# Altium project PCB_Project.PrjPcb
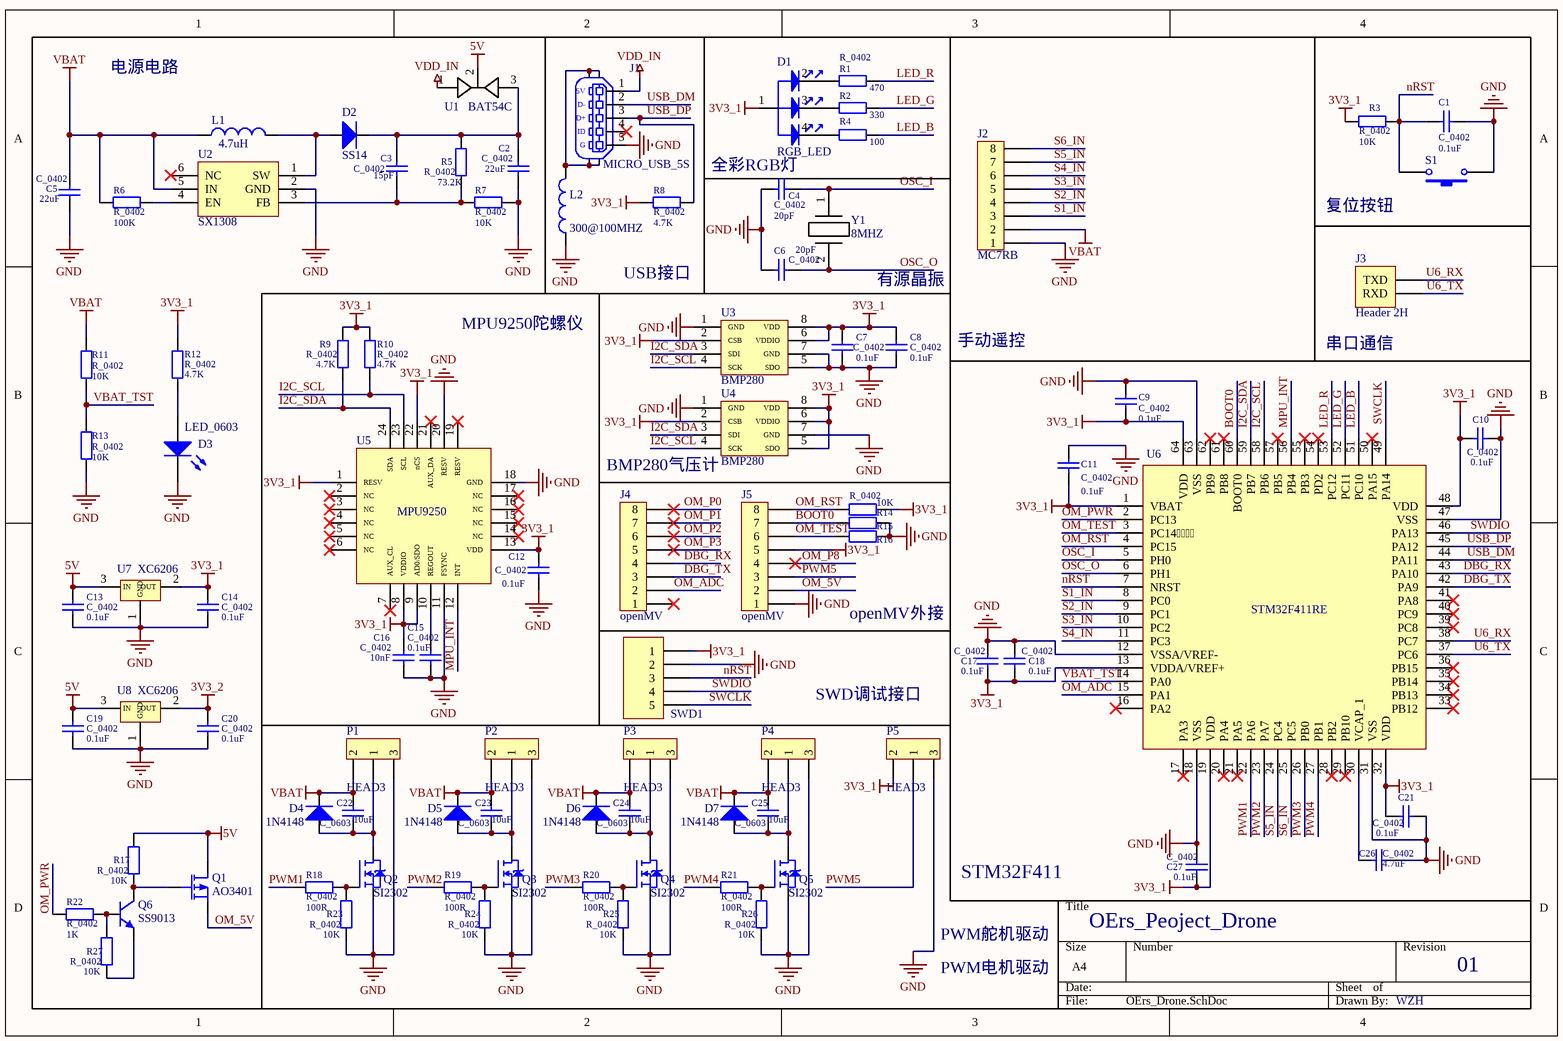
[diagram p0: OErs_Drone.SchDoc]
1 sheet, 90 parts. Net scope: global (net labels, ports and power ports of the same name join across sheets).
Board file: OErs_Drone.PcbDoc

## Sheet OErs_Drone.SchDoc
size A4

### Parts
C1  C_0402  value 0.1uF  [C0402]
C2  C_0402  value 22uF  [C0402]
C3  C_0402  value 15pF  [C0402]
C4  C_0402  value 20pF  [C0402]
C5  C_0402  value 22uF  [C0402]
C6  C_0402  value 20pF  [C0402]
C7  C_0402  value 0.1uF  [C0402]
C8  C_0402  value 0.1uF  [C0402]
C9  C_0402  value 0.1uF  [C0402]
C10  C_0402  value 0.1uF  [C0402]
C11  C_0402  value 0.1uF  [C0402]
C12  C_0402  value 0.1uF  [C0402]
C13  C_0402  value 0.1uF  [C0402]
C14  C_0402  value 0.1uF  [C0402]
C15  C_0402  value 0.1uF  [C0402]
C16  C_0402  value 10nF  [C0402]
C17  C_0402  value 0.1uF  [C0402]
C18  C_0402  value 0.1uF  [C0402]
C19  C_0402  value 0.1uF  [C0402]
C20  C_0402  value 0.1uF  [C0402]
C21  C_0402  value 0.1uF  [C0402]
C22  C_0603  value 10uF  [C0603]
C23  C_0603  value 10uF  [C0603]
C24  C_0603  value 10uF  [C0603]
C25  C_0603  value 10uF  [C0603]
C26  C_0402  value 4.7uF  [C0402]
C27  C_0402  value 0.1uF  [C0402]
D1  RGB_LED  [LED-RGB]
D2  SS14  [SMA_L4.4-W2.8-LS5.4-RD]
D3  LED_0603  [LED0603-FD]
D4  1N4148  [SOD-123_L2.8-W1.8-LS3.7-RD]
D5  1N4148  [SOD-123_L2.8-W1.8-LS3.7-RD]
D6  1N4148  [SOD-123_L2.8-W1.8-LS3.7-RD]
D7  1N4148  [SOD-123_L2.8-W1.8-LS3.7-RD]
J1  MICRO_USB_5S  [MICRO-USB-SMD_U254-051T-4BH83-F1S]
J2  MC7RB  [HDR1X8]
J3  Header 2H  [HDR1X2]
J4  openMV  [HDR1X8]
J5  openMV  [HDR1X8]
L1  value 4.7uH  [0603]
L2  value 300@100MHZ  [0603]
P1  HEAD3  [HDR1X3]
P2  HEAD3  [HDR1X3]
P3  HEAD3  [HDR1X3]
P4  HEAD3  [HDR1X3]
P5  HEAD3  [HDR1X3]
Q1  AO3401  [SOT-23-3_L2.9-W1.3-P1.90-LS2.4-BR]
Q2  SI2302  [SOT-23-3_L2.9-W1.3-P1.90-LS2.4-BR]
Q3  SI2302  [SOT-23-3_L2.9-W1.3-P1.90-LS2.4-BR]
Q4  SI2302  [SOT-23-3_L2.9-W1.3-P1.90-LS2.4-BR]
Q5  SI2302  [SOT-23-3_L2.9-W1.3-P1.90-LS2.4-BR]
Q6  SS9013  [TO-92A]
R1  R_0402  value 470  [R0402]
R2  value 330  [R0402]  (hidden comment: R_0402)
R3  R_0402  value 10K  [R0402]
R4  value 100  [R0402]  (hidden comment: R_0402)
R5  R_0402  value 73.2K  [R0402]
R6  R_0402  value 100K  [R0402]
R7  R_0402  value 10K  [R0402]
R8  R_0402  value 4.7K  [R0402]
R9  R_0402  value 4.7K  [R0402]
R10  R_0402  value 4.7K  [R0402]
R11  R_0402  value 10K  [R0402]
R12  R_0402  value 4.7K  [R0402]
R13  R_0402  value 10K  [R0402]
R14  R_0402  value 10K  [R0402]
R15  R_0402  [R0402]  (value not drawn)
R16  R_0402  [R0402]  (value not drawn)
R17  R_0402  value 10K  [R0402]
R18  R_0402  value 100R  [R0402]
R19  R_0402  value 100R  [R0402]
R20  R_0402  value 100R  [R0402]
R21  R_0402  value 100R  [R0402]
R22  R_0402  value 1K  [R0402]
R23  R_0402  value 10K  [R0402]
R24  R_0402  value 10K  [R0402]
R25  R_0402  value 10K  [R0402]
R26  R_0402  value 10K  [R0402]
R27  R_0402  value 10K  [R0402]
S1  667  [KEY-TH_4P-L6.0-W6.0-P4.50-LS6.5]  (value not drawn)
SWD1  SWD  [HDR1X5]  (value not drawn)
U1  BAT54C  [SOT-23-3_L2.9-W1.6-P1.90-LS2.8-BR]
U2  SX1308  [SOT-23-6_L2.9-W1.6-P0.95-LS2.8-BR]
U3  BMP280  [SENSOR-TH_BMP280-BL]
U4  BMP280  [SENSOR-TH_BMP280-BL]
U5  MPU9250  [MPU9250]
U6  STM32F411RE  [LQFP-64_L10.0-W10.0-P0.50-LS12.0-BL]
U7  XC6206  [SOT-23-3_L3.0-W1.7-P0.95-LS2.9-BR]
U8  XC6206  [SOT-23-3_L3.0-W1.7-P0.95-LS2.9-BR]
Y1  8MHZ  [OSC-SMD_L5.0-W3.2]

### Nets
3V3_1: C7.2 C8.2 C9.1 C10.1 C11.1 C12.2 C14.2 C16.2 C17.1 C18.1 C21.2 C27.2 D1.1 J5.5 P5.2 R3.2 R8.2 R9.2 R10.2 R12.2 R14.1 SWD1.1 U3.2(CSB) U3.6(VDDIO) U3.8(VDD) U4.2(CSB) U4.5(SDO) U4.6(VDDIO) U4.8(VDD) U5.1(RESV) U5.8(VDDIO) U5.9(AD0/SDO) U5.13(VDD) U5.22(nCS) U6.1(VBAT) U6.13(VDDA/VREF+) U6.19(VDD) U6.32(VDD) U6.48(VDD) U6.64(VDD) U7.2(OUT)
3V3_2: C20.2 U8.2(OUT)
5V: C13.2 C19.2 Q1.3(D) R17.2 U1.2 U7.3(IN) U8.3(IN)
GND: C1.1 C2.1 C4.2 C5.1 C6.2 C7.1 C8.1 C9.2 C10.2 C11.2 C12.1 C13.1 C14.1 C15.1 C16.1 C17.2 C18.2 C19.1 C20.1 C21.1 C26.1 C27.1 D3.2(K) J1.5(G) J2.1 J5.1 L2.1 P1.3 P2.3 P3.3 P4.3 P5.3 Q2.2(S) Q3.2(S) Q4.2(S) Q5.2(S) R7.1 R13.2 R15.1 R16.1 R23.1 R24.1 R25.1 R26.1 S1.1 SWD1.2 U2.2(GND) U3.1(GND) U3.5(SDO) U3.7(GND) U4.1(GND) U4.7(GND) U5.11(FSYNC) U5.18(GND) U5.20(RESV) U6.12(VSSA/VREF-) U6.18(VSS) U6.31(VSS) U6.47(VSS) U6.63(VSS) U7.1(GND) U8.1(GND)
VBAT: C5.2 C22.2 C23.2 C24.2 C25.2 D4.2(K) D5.2(K) D6.2(K) D7.2(K) J2.2 L1.1 P1.2 P2.2 P3.2 P4.2 R6.2 R11.1 U2.5(IN)
VDD_IN: J1.1(5V) U1.1
BOOT0: J5.7 R15.2 U6.60(BOOT0)
DBG_RX: J4.4 U6.43(PA10)
DBG_TX: J4.3 U6.42(PA9)
I2C_SCL: R10.1 U3.4(SCK) U4.4(SCK) U5.23(SCL) U6.58(PB6)
I2C_SDA: R9.1 U3.3(SDI) U4.3(SDI) U5.24(SDA) U6.59(PB7)
LED_B: R4.1 U6.51(PC10)
LED_G: R2.1 U6.52(PC11)
LED_R: R1.1 U6.53(PC12)
MPU_INT: U5.12(INT) U6.56(PB4)
nRST: C1.2 R3.1 S1.3 SWD1.3 U6.7(NRST)
OM_5V: J5.2 Q1.2(S)
OM_ADC: J4.2 U6.15(PA1)
OM_P0: J4.8
OM_P1: J4.7
OM_P2: J4.6
OM_P3: J4.5
OM_P8: J5.4
OM_PWR: R22.2 U6.2(PC13)
OM_RST: J5.8 R14.2 U6.4(PC15)
OM_TEST: J5.6 R16.2 U6.3(PC14)
OSC_I: C4.1 U6.5(PH0) Y1.1
OSC_O: C6.1 U6.6(PH1) Y1.2
PWM1: R18.2 U6.22(PA6)
PWM2: R19.2 U6.23(PA7)
PWM3: R20.2 U6.26(PB0)
PWM4: R21.2 U6.27(PB1)
PWM5: J5.3 P5.1
S1_IN: J2.3 U6.8(PC0)
S2_IN: J2.4 U6.9(PC1)
S3_IN: J2.5 U6.10(PC2)
S4_IN: J2.6 U6.11(PC3)
S5_IN: J2.7 U6.24(PC4)
S6_IN: J2.8 U6.25(PC5)
SWCLK: SWD1.5 U6.49(PA14)
SWDIO: SWD1.4 U6.46(PA13)
U6_RX: J3.2(TXD) U6.38(PC7)
U6_TX: J3.1(RXD) U6.37(PC6)
USB_DM: J1.2(D-) U6.44(PA11)
USB_DP: J1.3(D+) R8.1 U6.45(PA12)
VBAT_TST: R11.2 R13.1 U6.14(PA0)
NetC2_2: C2.2 C3.2 D2.2(K) R5.2 U1.3
NetC3_1: C3.1 R5.1 R7.2 U2.3(FB)
NetC15_2: C15.2 U5.10(REGOUT)
NetC22_1: C22.1 D4.1(A) P1.1 Q2.3(D)
NetC23_1: C23.1 D5.1(A) P2.1 Q3.3(D)
NetC24_1: C24.1 D6.1(A) P3.1 Q4.3(D)
NetC25_1: C25.1 D7.1(A) P4.1 Q5.3(D)
NetC26_2: C26.2 U6.30(VCAP_1)
NetD1_2: D1.2 R1.2
NetD1_3: D1.3 R2.2
NetD1_4: D1.4 R4.2
NetD2_1: D2.1(A) L1.2 U2.1(SW)
NetD3_1: D3.1(A) R12.1
NetJ1_6: J1.6 J1.7 J1.8 J1.9 L2.2
NetQ1_1: Q1.1(G) Q6.3(C) R17.1
NetQ2_1: Q2.1(G) R18.1 R23.2
NetQ3_1: Q3.1(G) R19.1 R24.2
NetQ4_1: Q4.1(G) R20.1 R25.2
NetQ5_1: Q5.1(G) R21.1 R26.2
NetQ6_1: Q6.1(E) R27.1
NetQ6_2: Q6.2(B) R22.1 R27.2
NetR6_1: R6.1 U2.4(EN)

Not connected (* = marked no-connect by the designer): J1 4(ID)*; J4 1*; S1 2 4; U2 6(NC)*; U5 2(NC)* 3(NC)* 4(NC)* 5(NC)* 6(NC)* 7(AUX_CL)* 14(NC)* 15(NC)* 16(NC)* 17(NC)* 19(RESV)* 21(AUX_DA)*; U6 16(PA2)* 17(PA3)* 20(PA4)* 21(PA5)* 28(PB2)* 29(PB10)* 33(PB12)* 34(PB13)* 35(PB14)* 36(PB15)* 39(PC8)* 40(PC9)* 41(PA8)* 50(PA15)* 54(PD2)* 55(PB3)* 57(PB5)* 61(PB8)* 62(PB9)*

### Notes on the sheet
- 电源电路
- 全彩RGB灯
- 复位按钮
- USB接口
- 有源晶振
- MPU9250陀螺仪
- 手动遥控
- 串口通信
- BMP280气压计
- openMV外接
- SWD调试接口
- STM32F411
- (near C27) OErs_Peoject_Drone
- PWM电机驱动
- PWM舵机驱动
- 01
- WZH

### Library data of the parts
C1-C27 = Cap: Capacitor; Published: 8-Jun-2000; LatestRevisionDate: 17-Jul-2002; LatestRevisionNote: Re-released for DXP Platform.; PackageReference: RAD-0.3; Publisher: Altium Limited; PackageDescription: Radial Cap, Thru-Hole; 2 Leads; 0.3 in Pin Spacing
D1 = RGB_LED: 全彩RGB
D2 D4-D7 = Diode: Default Diode; Published: 8-Jun-2000; LatestRevisionDate: 17-Jul-2002; LatestRevisionNote: Re-released for DXP Platform.; PackageVersion: Sep-1996; PackageReference: SMC; Publisher: Altium Limited; PackageDescription: DO-214-AB/SMC; 2 C-Bend Leads; Body 7.9 x 5.9 mm, inc. leads (LxW); Code_JEDEC: DO-214-AB
D3 = LED2: Typical RED, GREEN, YELLOW, AMBER GaAs LED; Published: 8-Jun-2000; LatestRevisionDate: 17-Jul-2002; LatestRevisionNote: Re-released for DXP Platform.; PackageVersion: Feb-2002; PackageReference: 3.2X1.6X1.1; Publisher: Altium Limited; PackageDescription: SM LED; 2 Flat Leads
J1 = MICRO_USB_5S: USB接口
J2 = openMV: 外接
J3 = Header 2H: Header, 2-Pin, Right Angle; LatestRevisionDate: 17-Jul-2002; LatestRevisionNote: Re-released for DXP Platform.; Publisher: Altium Limited
J4 J5 = openMV: 外接openmv模组
L1 L2 = Inductor: Code_IEC: 1005; Published: 8-Jun-2000; LatestRevisionDate: 29-May-2009; LatestRevisionNote: IPC-7351 Footprint Added.; PackageReference: 0402-A; Publisher: Altium Limited; PackageDescription: Chip Inductor; Code_JEITA: 0402
P1-P5 = HEAD3: 3脚插口
Q1 = MOSFET-P: P-Channel MOSFET; Published: 8-Jun-2000; LatestRevisionDate: 17-Jul-2002; LatestRevisionNote: Re-released for DXP Platform.; PackageVersion: 1995/1996; PackageReference: E3; Publisher: Altium Limited; PackageDescription: TO, Flat Index; 3 In-Line, Axial Leads; Body Dia. 4.6mm; Lead Dia. 0.5 mm (max)
Q2-Q5 = FDB52N20: N-Channel MOSFET
Q6 = 2N3904: NPN General Purpose Amplifier; Published: 8-Jun-2000; LatestRevisionDate: 15-Jan-2003; LatestRevisionNote: PCB Footprint 'BCY-W3/D4.7' replaced; DatasheetVersion: 1997; PackageVersion: Sep-1998; PackageReference: TO-92A; Publisher: Altium Limited; PackageDescription: TO, Flat Index; 3 In-Line, Axial Leads; Body Dia. 4.5mm; Leads 0.51 x 0.48 mm (max); ComponentLink1Description: Manufacturer Link; ComponentLink1URL: http://www.fairchildsemi.com/; ComponentLink2Description: Datasheet; ComponentLink2URL: http://www.fairchildsemi.com/ds/2N%2F2N3904.pdf
R1-R14 R17-R27 = Res2: Resistor; Published: 8-Jun-2000; LatestRevisionDate: 17-Jul-2002; LatestRevisionNote: Re-released for DXP Platform.; PackageReference: AXIAL-0.4; Publisher: Altium Limited; PackageDescription: Axial Device, Thru-Hole; 2 Leads; 0.4 in Pin Spacing
R15 R16 = Res2: Resistor; Value: 10K; Published: 8-Jun-2000; LatestRevisionDate: 17-Jul-2002; LatestRevisionNote: Re-released for DXP Platform.; PackageReference: AXIAL-0.4; Publisher: Altium Limited; PackageDescription: Axial Device, Thru-Hole; 2 Leads; 0.4 in Pin Spacing
S1 = SW-PB: Switch; Published: 24-Mar-1999; LatestRevisionDate: 17-Jul-2002; LatestRevisionNote: Re-released for DXP Platform.; PackageReference: SPST-2; Publisher: Altium Limited; PackageDescription: Switch; 2 Leads
SWD1 = SWD: Header, 5-Pin; LatestRevisionDate: 17-Jul-2002; LatestRevisionNote: Re-released for DXP Platform.; Publisher: Altium Limited
U1 = BAT54C: 二通一限流
U2 = SX1308: 电源控制
U3 U4 = BMP280: 气压计
U5 = MPU9250: 9轴陀螺仪传感器
U6 = STM32F411RE: 单片机
U7 U8 = XC6206: 5to3.3
Y1 = SMD5032: 晶振